# Altium schematic sheet Sheet_1_2021-12-20.schdoc
size 53 x 35 mm
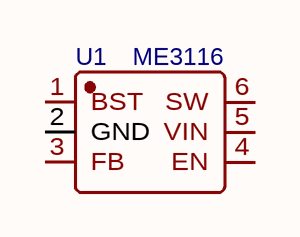
[diagram p0: Sheet_1_2021-12-20.schdoc]

## Parts
U1  ME3116  [SOT-23-6_L2.9-W1.6-P0.95-LS2.8-BL]

## Nets

Not connected (* = marked no-connect by the designer): U1 1(BST) 2(GND) 3(FB) 4(EN) 5(VIN) 6(SW)

## Library data of the parts
U1 = TP6841S6-A: BOM_Manufacturer: TECH PUBLIC(台舟); Contributor: LCSC; BOM_Supplier: LCSC; BOM_Supplier Part: C2844924; BOM_Manufacturer Part: TP6841S6-A; BOM_JLCPCB Part Class: Extended Part; spicePre: U; spiceSymbolName: TP6841S6-A